# Altium schematic sheet MC33797.SchDoc: Top Sheet
size A4; Project: World Domination Satellite
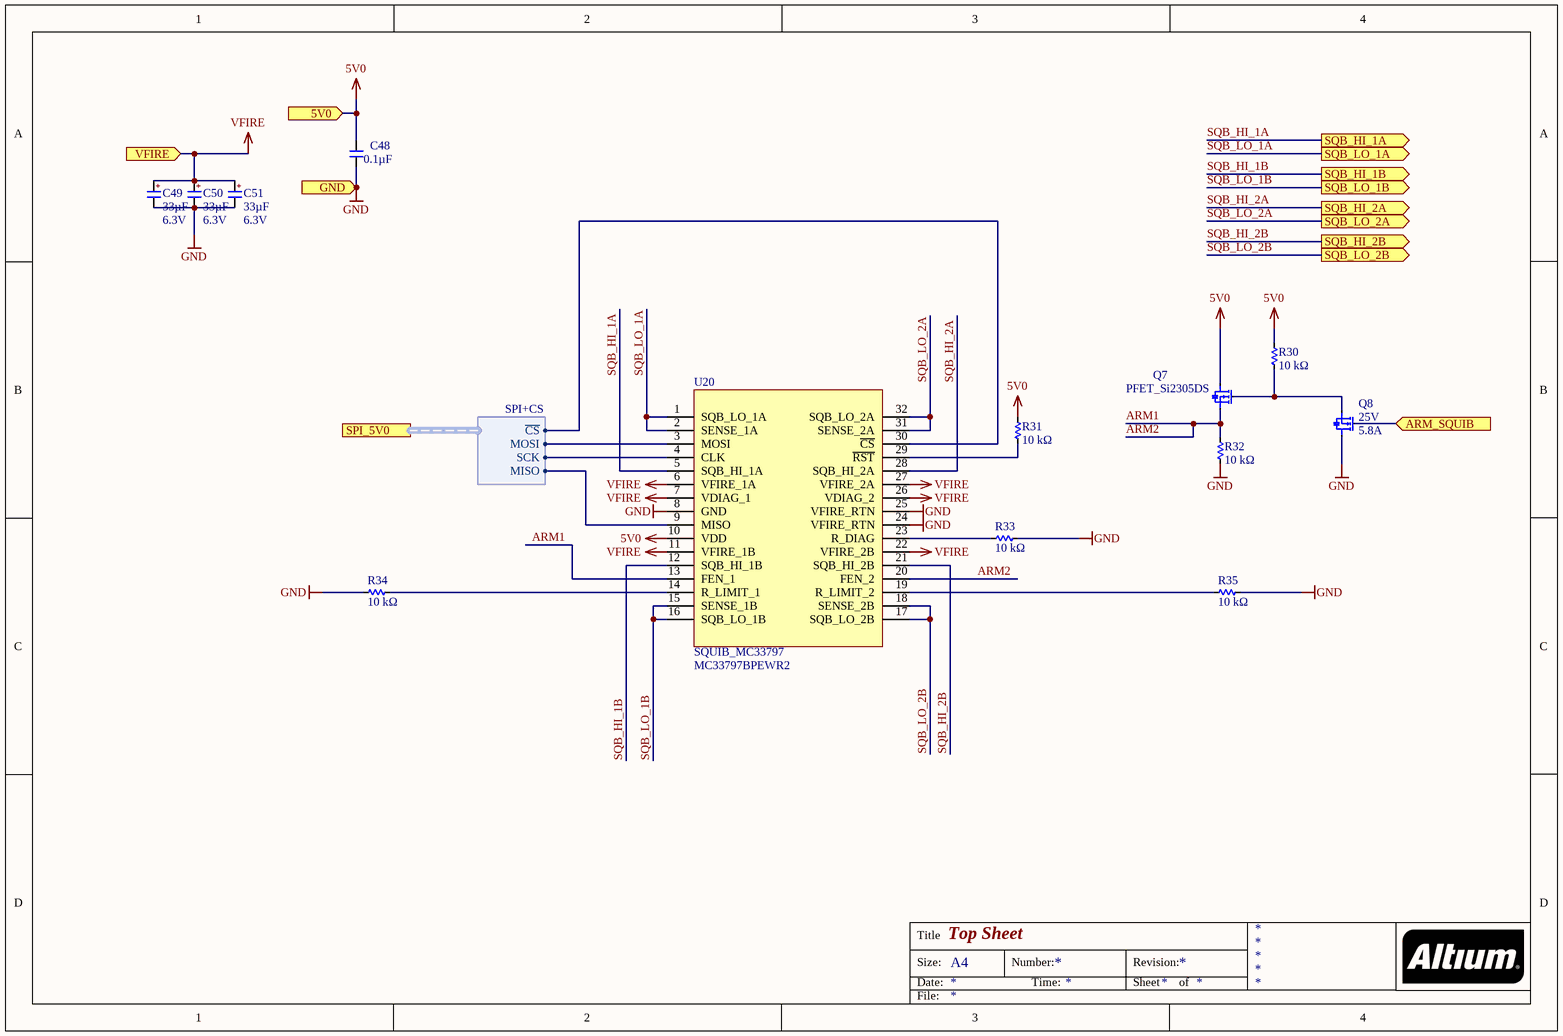
[diagram p0: MC33797.SchDoc]

## Parts
C48  Capacitance: 0.1µF  [C0603]  (hidden comment: CAP_CER_100NF_100V)
C49  Capacitance: 33µF  Voltage - Rated: 6.3V  [C1206P]  (hidden comment: CAP_TANT_33UF)
C50  Capacitance: 33µF  Voltage - Rated: 6.3V  [C1206P]  (hidden comment: CAP_TANT_33UF)
C51  Capacitance: 33µF  Voltage - Rated: 6.3V  [C1206P]  (hidden comment: CAP_TANT_33UF)
Q7  PFET_Si2305DS  [3SOT23]
Q8  Drain to Source Voltage (Vdss): 25V  Current - Continuous Drain (Id) @ 25° C: 5.8A  [3SOT23]  (hidden comment: NFET_IRFML8244TRPBF)
R30  Resistance: 10 kΩ  [R0603]  (hidden comment: 311-10.0KHRCT-ND)
R31  Resistance: 10 kΩ  [R0603]  (hidden comment: 311-10.0KHRCT-ND)
R32  Resistance: 10 kΩ  [R0603]  (hidden comment: 311-10.0KHRCT-ND)
R33  Resistance: 10 kΩ  [R0603]  (hidden comment: 311-10.0KHRCT-ND)
R34  Resistance: 10 kΩ  [R0603]  (hidden comment: 311-10.0KHRCT-ND)
R35  Resistance: 10 kΩ  [R0603]  (hidden comment: 311-10.0KHRCT-ND)
U20  SQUIB_MC33797  Manufacturer Part Number: MC33797BPEWR2  [SOT1762-1]

## Ports
5V0 (in), ARM_SQUIB (in), GND (in), SPI_5V0 (harness SPI+CS), SQB_HI_1A (out), SQB_HI_1B (out), SQB_HI_2A (out), SQB_HI_2B (out), SQB_LO_1A (out), SQB_LO_1B (out), SQB_LO_2A (out), SQB_LO_2B (out), VFIRE (in)

## Harnesses
SPI+CS: ~{CS}, SCK, MOSI, MISO

## Nets
5V0: C48.1 Q7.3 R30.2 R31.2 U20.10(VDD) ; port 5V0
GND: C48.2 C49.2 C50.2 C51.2 Q8.3 R32.1 R33.2 R34.1 R35.2 U20.8(GND) U20.24(VFIRE_RTN) U20.25(VFIRE_RTN) ; port GND
VFIRE: C49.1 C50.1 C51.1 U20.6(VFIRE_1A) U20.7(VDIAG_1) U20.11(VFIRE_1B) U20.22(VFIRE_2B) U20.26(VDIAG_2) U20.27(VFIRE_2A) ; port VFIRE
ARM1: Q7.2 R32.2 U20.13(FEN_1) U20.20(FEN_2)  [also labelled ARM2]
ARM_SQUIB: Q8.1 ; port ARM_SQUIB
SQB_HI_1A: U20.5(SQB_HI_1A) ; port SQB_HI_1A
SQB_HI_1B: U20.12(SQB_HI_1B) ; port SQB_HI_1B
SQB_HI_2A: U20.28(SQB_HI_2A) ; port SQB_HI_2A
SQB_HI_2B: U20.21(SQB_HI_2B) ; port SQB_HI_2B
SQB_LO_1A: U20.1(SQB_LO_1A) U20.2(SENSE_1A) ; port SQB_LO_1A
SQB_LO_1B: U20.15(SENSE_1B) U20.16(SQB_LO_1B) ; port SQB_LO_1B
SQB_LO_2A: U20.31(SENSE_2A) U20.32(SQB_LO_2A) ; port SQB_LO_2A
SQB_LO_2B: U20.17(SQB_LO_2B) U20.18(SENSE_2B) ; port SQB_LO_2B
NetQ7_1: Q7.1 Q8.2 R30.1
NetR31_1: R31.1 U20.29(~{RST})
NetR33_1: R33.1 U20.23(R_DIAG)
NetR34_2: R34.2 U20.14(R_LIMIT_1)
NetR35_1: R35.1 U20.19(R_LIMIT_2)
NetU20_3: U20.3(MOSI) ; port SPI_5V0.MOSI
NetU20_4: U20.4(CLK) ; port SPI_5V0.SCK
NetU20_9: U20.9(MISO) ; port SPI_5V0.MISO
NetU20_30: U20.30(~{CS}) ; port SPI_5V0.~{CS}

## Notes on the sheet
- Title
- Size:
- Date:
- A4
- Number:
- Time:
- Revision:
- Sheet
- of
- File:
- (in symbol CMP-026-0002-1) +

## Library data of the parts
C48 = CMP-027-0018-1: CAP CER 0.1UF 100V X7S 0603; Manufacturer: TDK Corporation; Manufacturer Part Number: C1608X7S2A104K080AB; Tolerance: ±10%; Failure Rate: -; Mounting Type: Surface Mount, MLCC; Pricing 1: 1=0.19, 10=0.133, 100=0.0673, 500=0.04604, 1000=0.04073 (USD); RoHS: RoHS Compliant; ComponentLink1Description: https://product.tdk.com/info/en/catalog/datasheets/mlcc_commercial_midvoltage_en.pdf; Features: -; Design Item ID: CAP_CER_100NF_100V; Lead Spacing: -; Source: capacitor.SchLib; Packaging: Cut Tape (CT); Lead Style: -; Ratings: -; Part Status: Active; Temperature Coefficient: X7S; Operating Temperature: -55°C ~ 125°C; ComponentLink1URL: https://product.tdk.com/info/en/catalog/datasheets/mlcc_commercial_midvoltage_en.pdf; Stock 1: 662530; Size / Dimension: 0.063" L x 0.031" W (1.60mm x 0.80mm); Voltage - Rated: 100V; Applications: General Purpose; Package / Case: 0603 (1608 Metric); Thickness (Max): 0.037" (0.95mm); Height - Seated (Max): -
C49-C51 = CMP-026-0002-1: Manufacturer: AVX Corporation; Manufacturer Part Number: TPSA336K006R0600; Manufacturer Size Code: A; Tolerance: ±10%; ESR (Equivalent Series Resistance): 600 mOhm; RoHS: RoHS Compliant; Packaging: Cut Tape (CT); Part Status: Active; Operating Temperature: -55°C ~ 125°C; Features: General Purpose; Mounting Type: Surface Mount; Package / Case: 1206 (3216 Metric); Size / Dimension: 0.126" L x 0.063" W (3.20mm x 1.60mm); Height - Seated (Max): 0.071" (1.80mm); Lead Spacing: -; Lifetime @ Temp.: -; ComponentLink1URL: http://datasheets.avx.com/TPS.pdf; Stock 1: 27700; ComponentLink1Description: http://datasheets.avx.com/TPS.pdf; Pricing 1: 1=0.52, 10=0.371, 25=0.3168, 50=0.2806, 100=0.2444, 250=0.20816, 500=0.181, 1000=0.15385 (USD); Design Item ID: CAP_TANT_33UF; Failure Rate: -; Source: capacitor.SchLib
Q7 = CMP-078-0012-1: MOSFET P-CH; Design Item ID: PFET_Si2305DS; Source: transistor_fet.SchLib
Q8 = CMP-078-0046-1: MOSFET N-CH 25V 5.8A SOT23; Manufacturer: International Rectifier; FET Type: MOSFET N-Channel, Metal Oxide; FET Feature: Logic Level Gate; Rds On (Max) @ Id, Vgs: 24 mOhm @ 5.8A, 10V; Vgs(th) (Max) @ Id: 2.35V @ 10µA; Gate Charge (Qg) @ Vgs: 5.4nC @ 10V; Input Capacitance (Ciss) @ Vds: 430pF @ 10V; Power - Max: 1.25W; Manufacturer Part Number: IRFML8244TRPBF; RoHS: RoHS Compliant; Stock 1: 13542; Pricing 1: 1=0.41, 10=0.23, 100=0.1491, 250=0.13548, 500=0.1219, 1000=0.11411 (USD); Mounting Type: Surface Mount; Package / Case: TO-236-3, SC-59, SOT-23-3; Supplier Device Package: SOT-23; Packaging: Cut Tape (CT); ComponentLink1URL: http://www.irf.com/product-info/datasheets/data/irfml8244pbf.pdf; ComponentLink1Description: Datasheet; Design Item ID: NFET_IRFML8244TRPBF; Source: transistor_fet.SchLib
R30-R35 = CMP-126-0273-2: RES SMD 10K OHM 1% 1/10W 0603; Manufacturer Part Number: RC0603FR-0710KL; Manufacturer: Yageo; Resistance (Sortable): 10000; Power (Watts): 0.1W, 1/10W; Temperature Coefficient: ±100ppm/°C; Datasheets: http://www.yageo.com/documents/recent/PYu-RC_Group_51_RoHS_L_9.pdf; Image: //media.digikey.com/Renders/Yageo%20Renders/0603-(1608-Metric).jpg; Tolerance: ±1%; Operating Temperature: -55°C ~ 155°C
U20 = CMP-045-0005-1: Manufacturer: NXP USA Inc.; Interface: SPI; Voltage - Supply: 4.75 V ~ 5.25 V; RoHS: RoHS Compliant; Packaging: Cut Tape (CT); Part Status: Active; Applications: -; Package / Case: 32-SOIC (0.295", 7.50mm Width); Supplier Device Package: 32-SOIC; Mounting Type: Surface Mount; ComponentLink1URL: http://cache.freescale.com/files/analog/doc/data_sheet/MC33797.pdf; ComponentLink1Description: http://cache.freescale.com/files/analog/doc/data_sheet/MC33797.pdf; Source: ic_interface.SchLib; Design Item ID: SQUIB_MC33797